# Altium schematic sheet Control_Sense_TOP_VAC.SchDoc (part 4 of 4)
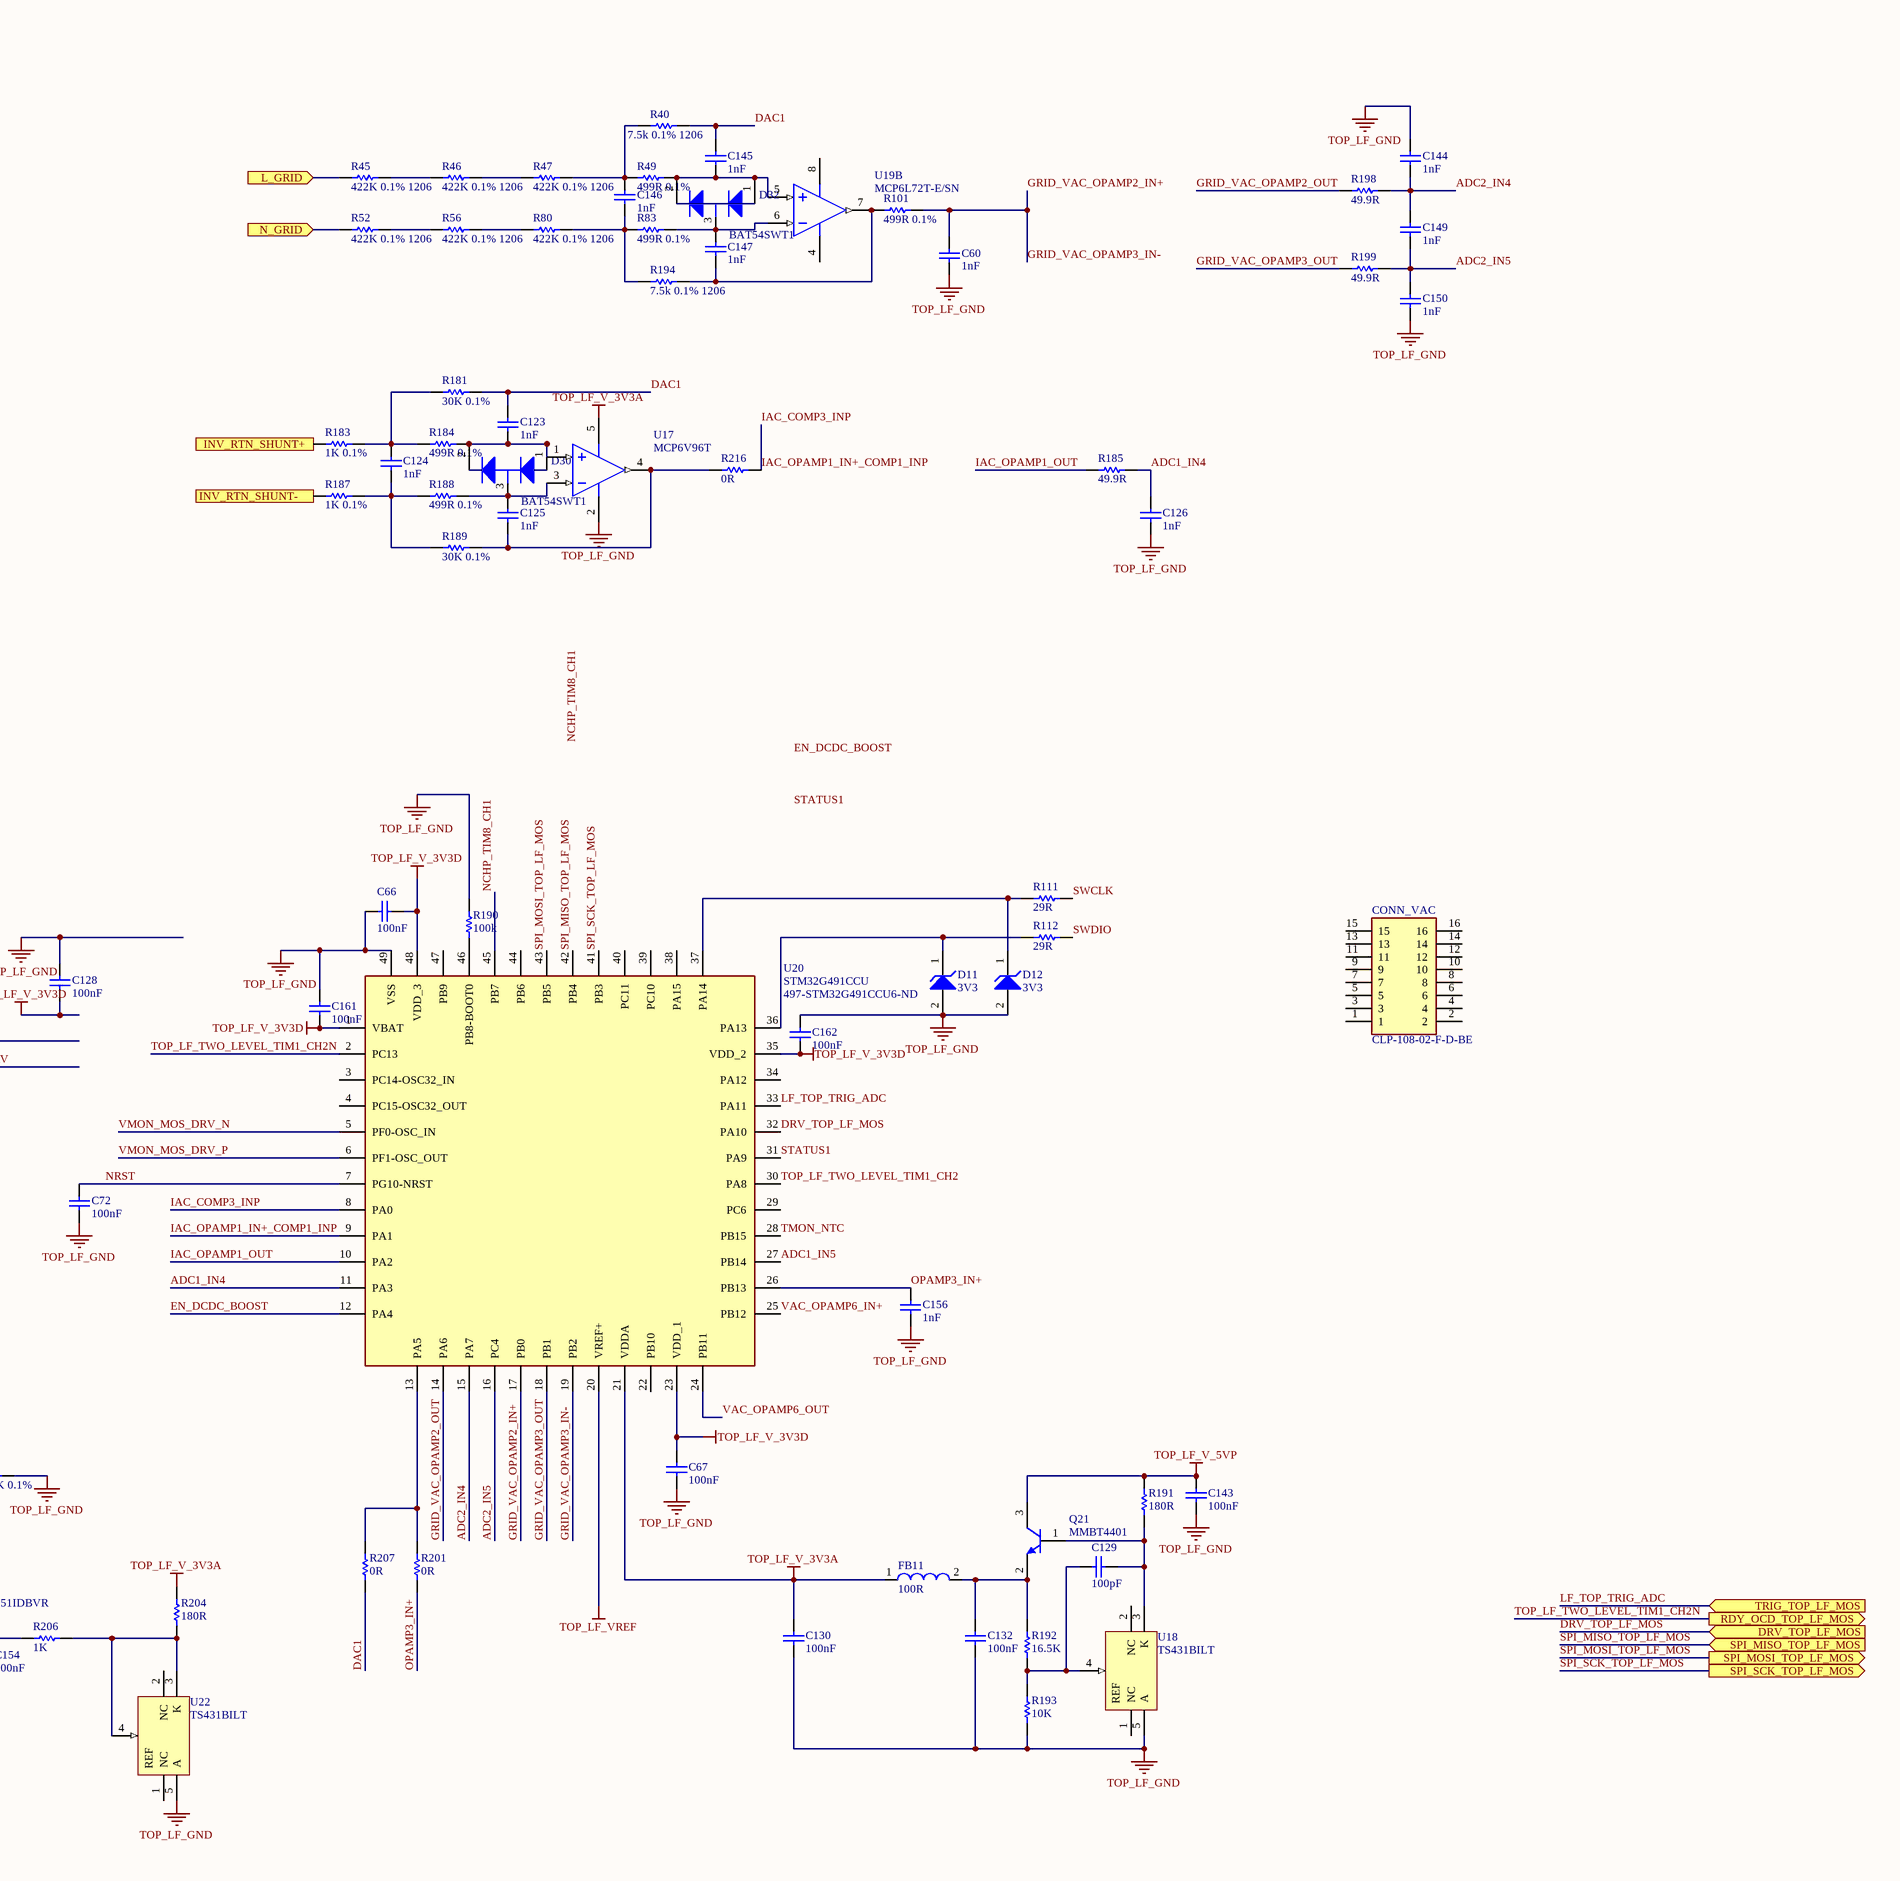
[diagram p6: Control_Sense_TOP_VAC.SchDoc, bottom right]

## Library data of the parts (continued)
R202 = CMP-2000-00873-1: Manufacturer: Panasonic; Part Number: ERA3AEB102V; Manufacturer Part Number: ERA-3AEB102V; Resistance: 1kR; Power Rating: 100mW; Temperature Coefficient: 25ppm/°C; Voltage Rating: 75V; Supplier 1: RSComponents; Supplier Part Number 1: 0566800P; RoHS: Yes; Category: Chip SMD Resistors; Stock 1: 1; Pricing 1: 5=0.38700, 50=0.32600, 250=0.12700, 1250=0.06600, 2500=0.04700 (USD); Mount: Surface Mount; Case/Package: 0603; Number of Pins: 2; Case Code (Imperial): 0603; Case Code (Metric): 1608; Contact Plating: Tin; Size Code: 0603; Min Operating Temperature: -55°C; Max Operating Temperature: 155°C; Packaging: Tape and Reel; Resistor Type: Thin Film; Tolerance: 0.1%; Number of Terminations: 2; Series: ERA-3A; Max Power Dissipation: 100mW; Construction: Rectangular; Package Quantity: 5000; Termination: SMD/SMT; Resistance Tolerance: 0.1%; Technology: METAL FILM; Length: 1.6mm; Width: 0.8mm; Height: 0.45mm; Depth: 0.8mm; Radiation Hardening: No; RoHS Compliant: Yes; Military Standard: Not; REACH SVHC: No SVHC; ComponentLink1URL: https://datasheet.ciiva.com/11808/0900766b80fe20f7-11808019.pdf?src-supplier=RSComponents; ComponentLink1Description: https://datasheet.ciiva.com/11808/0900766b80fe20f7-11808019.pdf?src-supplier=RSComponents; ComponentLink2URL: https://datasheet.ciiva.com/29183/450752-da-01-en-widerstand-0603-era-29183754.pdf?src-supplier=Conrad; ComponentLink2Description: https://datasheet.ciiva.com/29183/450752-da-01-en-widerstand-0603-era-29183754.pdf?src-supplier=Conrad; ComponentLink3URL: https://datasheet.ciiva.com/24071/aoa0000ce26-197354-24071510.pdf?src-supplier=Mouser; ComponentLink3Description: https://datasheet.ciiva.com/24071/aoa0000ce26-197354-24071510.pdf?src-supplier=Mouser; ComponentLink4URL: https://datasheet.ciiva.com/48530/era-eng-tds-48530582.pdf?src-supplier=Distrelec; ComponentLink4Description: https://datasheet.ciiva.com/48530/era-eng-tds-48530582.pdf?src-supplier=Distrelec; ComponentLink5URL: https://datasheet.ciiva.com/16781/70068849-16781703.pdf?src-supplier=Allied+Electronics; ComponentLink5Description: https://datasheet.ciiva.com/16781/70068849-16781703.pdf?src-supplier=Allied+Electronics; ComponentLink6URL: https://datasheet.ciiva.com/46422/1776116-46422455.pdf?src-supplier=Element14; ComponentLink6Description: https://datasheet.ciiva.com/46422/1776116-46422455.pdf?src-supplier=Element14; ComponentLink7URL: https://datasheet.ciiva.com/46422/485442-46422519.pdf?src-supplier=Element14; ComponentLink7Description: https://datasheet.ciiva.com/46422/485442-46422519.pdf?src-supplier=Element14; ComponentLink8URL: https://datasheet.ciiva.com/28531/485442-28531944.pdf?src-supplier=Element14; ComponentLink8Description: https://datasheet.ciiva.com/28531/485442-28531944.pdf?src-supplier=Element14; ComponentLink9URL: https://datasheet.ciiva.com/16426/aoa0000ce26-16426809.pdf?src-supplier=Future+Electronics; ComponentLink9Description: https://datasheet.ciiva.com/16426/aoa0000ce26-16426809.pdf?src-supplier=Future+Electronics; ComponentLink10URL: https://datasheet.ciiva.com/5734/aoa0000ce26-5734524.pdf?src-supplier=Farnell; ComponentLink10Description: https://datasheet.ciiva.com/5734/aoa0000ce26-5734524.pdf?src-supplier=Farnell; ComponentLink11URL: https://datasheet.ciiva.com/9198/aoa0000ce26-9198972.pdf?src-supplier=Avnet; ComponentLink11Description: https://datasheet.ciiva.com/9198/aoa0000ce26-9198972.pdf?src-supplier=Avnet; ComponentLink12URL: https://datasheet.ciiva.com/5734/485442-5734525.pdf?src-supplier=Farnell; ComponentLink12Description: https://datasheet.ciiva.com/5734/485442-5734525.pdf?src-supplier=Farnell; ComponentLink13URL: https://datasheet.ciiva.com/16725/70068849-16725038.pdf?src-supplier=Allied+Electronics; ComponentLink13Description: https://datasheet.ciiva.com/16725/70068849-16725038.pdf?src-supplier=Allied+Electronics; ComponentLink14URL: https://datasheet.ciiva.com/16853/aoa0000ce26-16853231.pdf?src-supplier=Avnet+Europe; ComponentLink14Description: https://datasheet.ciiva.com/16853/aoa0000ce26-16853231.pdf?src-supplier=Avnet+Europe; ComponentLink15URL: https://datasheet.ciiva.com/46393/1776116-46393695.pdf?src-supplier=Element14; ComponentLink15Description: https://datasheet.ciiva.com/46393/1776116-46393695.pdf?src-supplier=Element14
R203 = CMP-2000-00927-1: Part Number: ERA3AEB1651V; Manufacturer: Panasonic; Manufacturer Part Number: ERA-3AEB1651V; Resistance: 1.65kR; Power Rating: 100mW; Voltage Rating: 75V; Temperature Coefficient: 25ppm/°C; Supplier 1: Digi-Key; Supplier Part Number 1: P1.65KDBCT-ND; RoHS: Yes; Category: Chip SMD Resistors; Stock 1: 109834; Pricing 1: 1=0.31000, 10=0.26000, 100=0.10150, 1000=0.04248, 2500=0.03894 (USD); Mount: Surface Mount; Case/Package: 0603; Number of Pins: 2; Case Code (Imperial): 0603; Case Code (Metric): 1608; Contact Plating: Tin; Min Operating Temperature: -55°C; Max Operating Temperature: 155°C; Packaging: Tape and Reel; Tolerance: 0.1%; Resistor Type: Metal Film,Thin Film; Number of Terminations: 2; Package Quantity: 1; Voltage Rating (DC): 75V; Max Power Dissipation: 100mW; Features: Automotive AEC-Q200; Length: 1.6mm; Width: 0.8mm; Height: 0.45mm; Depth: 0.8mm; Radiation Hardening: No; REACH SVHC: No SVHC; Lead Free: Lead Free; Military Standard: Not; ComponentLink1URL: https://datasheet.ciiva.com/11809/0900766b80eb1d8c-11809743.pdf?src-supplier=RSComponents; ComponentLink1Description: https://datasheet.ciiva.com/11809/0900766b80eb1d8c-11809743.pdf?src-supplier=RSComponents; ComponentLink2URL: https://datasheet.ciiva.com/29183/451859-da-01-en-widerstand-0603-era-29183902.pdf?src-supplier=Conrad; ComponentLink2Description: https://datasheet.ciiva.com/29183/451859-da-01-en-widerstand-0603-era-29183902.pdf?src-supplier=Conrad; ComponentLink3URL: https://datasheet.ciiva.com/9197/aoa0000ce26-9197850.pdf?src-supplier=Avnet; ComponentLink3Description: https://datasheet.ciiva.com/9197/aoa0000ce26-9197850.pdf?src-supplier=Avnet; ComponentLink4URL: https://datasheet.ciiva.com/17214/aoa0000ce26-17214586.pdf?src-supplier=Avnet+Europe; ComponentLink4Description: https://datasheet.ciiva.com/17214/aoa0000ce26-17214586.pdf?src-supplier=Avnet+Europe; ComponentLink5URL: https://datasheet.ciiva.com/7920/485442-7920363.pdf?src-supplier=Element14; ComponentLink5Description: https://datasheet.ciiva.com/7920/485442-7920363.pdf?src-supplier=Element14; ComponentLink6URL: https://datasheet.ciiva.com/7920/485442-7920364.pdf?src-supplier=Element14; ComponentLink6Description: https://datasheet.ciiva.com/7920/485442-7920364.pdf?src-supplier=Element14
R205 = CMP-2000-00583-1: Manufacturer: Panasonic; Part Number: ERJ-3EKF59R0V; Power Rating: 100mW; Tolerance: 1%; Temperature Coefficient: 100ppm/°C; Voltage Rating: 75V; Voltage Rating (DC): 50V; Supplier 1: Digi-Key; Supplier Part Number 1: P59.0HCT-ND; Manufacturer Part Number: ERJ-3EKF59R0V; RoHS: Yes; Category: Chip SMD Resistors; Stock 1: 39151; Pricing 1: 1=0.10000, 10=0.03700, 100=0.01490, 1000=0.00670, 2500=0.00582 (USD); Mount: Surface Mount; Case/Package: 0603; Case Code (Metric): 1608; Case Code (Imperial): 0603; Contact Plating: Tin; Min Operating Temperature: -55°C; Max Operating Temperature: 155°C; Resistance: 59R; Packaging: Tape and Reel; Resistor Type: Thick Film; Number of Terminations: 2; Package Quantity: 1; Series: ERJ; Max Power Dissipation: 100mW; Termination: SMD/SMT; Resistance Tolerance: 1%; Features: Automotive AEC-Q200; Technology: THICK FILM; Construction: Rectangular; Length: 1.6mm; Width: 0.031inch; Height: 0.45mm; Depth: 0.8mm; RoHS Compliant: Yes; REACH SVHC: Yes; Lead Free: Contains Lead; Military Standard: Not; ComponentLink1URL: https://datasheet.ciiva.com/9188/aoa0000ce2-9188485.pdf?src-supplier=Avnet; ComponentLink1Description: https://datasheet.ciiva.com/9188/aoa0000ce2-9188485.pdf?src-supplier=Avnet; ComponentLink2URL: https://datasheet.ciiva.com/46420/1678782-46420341.pdf?src-supplier=Element14; ComponentLink2Description: https://datasheet.ciiva.com/46420/1678782-46420341.pdf?src-supplier=Element14; ComponentLink3URL: https://datasheet.ciiva.com/22729/1678782-22729158.pdf?src-supplier=Farnell; ComponentLink3Description: https://datasheet.ciiva.com/22729/1678782-22729158.pdf?src-supplier=Farnell; ComponentLink4URL: https://datasheet.ciiva.com/22673/1678782-22673800.pdf?src-supplier=Element14; ComponentLink4Description: https://datasheet.ciiva.com/22673/1678782-22673800.pdf?src-supplier=Element14; ComponentLink5URL: https://datasheet.ciiva.com/9188/aoa0000ce2-9188489.pdf?src-supplier=Avnet; ComponentLink5Description: https://datasheet.ciiva.com/9188/aoa0000ce2-9188489.pdf?src-supplier=Avnet; ComponentLink6URL: https://datasheet.ciiva.com/30242/aoa0000ce2-30242153.pdf?src-supplier=Onlinecomponents.com; ComponentLink6Description: https://datasheet.ciiva.com/30242/aoa0000ce2-30242153.pdf?src-supplier=Onlinecomponents.com; ComponentLink7URL: https://datasheet.ciiva.com/16777/70260748-16777979.pdf?src-supplier=Allied+Electronics; ComponentLink7Description: https://datasheet.ciiva.com/16777/70260748-16777979.pdf?src-supplier=Allied+Electronics
R216 = CMP-2100-03667-1: Chip Resistor, 0 Ohm, +/- 5%, 0.1 W, -55 to 155 degC, 0603 (1608 Metric), RoHS, Tape and Reel; Manufacturer: Yageo; Manufacturer Part Number: RC0603JR-070RL; Temperature Coefficient: 200ppm/degreesC; Voltage Rating: 50V; Power Rating: 100mW; Resistance: 0mOhm; Description: RES SMD 0 OHM JUMPER 1/10W 0603; Width: 0.8mm; Max Operating Temperature: 155degC; Tolerance: 5%; Package Reference: 0603; Height: 0.45mm; Depth: 0.8mm; Package Description: 2-Pin Surface Mount Device, Body 1.6 x 0.8 mm; Termination: SMD/SMT; Package Quantity: 5000; Case/Package: 0603; Case Code (Imperial): 0603; Radiation Hardening: No; Number of Pins: 2; Length: 1.6mm; Lead Free: LeadFree; Voltage Rating (DC): 50V; Military Standard: Not; Datasheet URL: http://www.yageo.com/NewPortal/yageodocoutput?fileName=/pdf/R-Chip/PYu-RC_Group_51_RoHS_L_5.pdf; Manufacturer URL: http://www.yageo.com/; Packaging: TapeandReel; Case Code (Metric): 1608; Min Operating Temperature: -55degC; Composition: ThickFilm; RoHSCompliant: true; Contact Plating: Tin; Datasheet Version: Rev. 5, 10/2016; REACH SVHC: NoSVHC; Supplier 1: Digi-Key; Supplier Part Number 1: 311-0.0GRCT-ND; RoHS: Yes; Category: Chip SMD Resistors; Stock 1: 8676367; Pricing 1: 1=0.10000, 10=0.01700, 25=0.01240, 50=0.00940, 100=0.00700, 250=0.00532, 500=0.00424, 1000=0.00313 (USD); Size Code: 0603; Resistor Type: Thick Film; Series: RC; Max Power Dissipation: 100mW; Construction: Rectangular; Number of Terminations: 2; Features: Moisture Resistant; Technology: THICK FILM; Resistance Tolerance: 5%; RoHS Compliant: Yes; ComponentLink1URL: https://datasheet.ciiva.com/11808/pyu-r-int-6-11808700.pdf?src-supplier=RSComponents; ComponentLink1Description: https://datasheet.ciiva.com/11808/pyu-r-int-6-11808700.pdf?src-supplier=RSComponents; ComponentLink2URL: https://datasheet.ciiva.com/22747/443971-22747530.pdf?src-supplier=Element14; ComponentLink2Description: https://datasheet.ciiva.com/22747/443971-22747530.pdf?src-supplier=Element14; ComponentLink3URL: https://datasheet.ciiva.com/12555/rc0603-272842-12555254.pdf?src-supplier=Mouser; ComponentLink3Description: https://datasheet.ciiva.com/12555/rc0603-272842-12555254.pdf?src-supplier=Mouser; ComponentLink4URL: https://datasheet.ciiva.com/7746/1738695-7746421.pdf?src-supplier=Element14; ComponentLink4Description: https://datasheet.ciiva.com/7746/1738695-7746421.pdf?src-supplier=Element14; ComponentLink5URL: https://datasheet.ciiva.com/7746/1738695-7746422.pdf?src-supplier=Element14; ComponentLink5Description: https://datasheet.ciiva.com/7746/1738695-7746422.pdf?src-supplier=Element14; ComponentLink6URL: https://datasheet.ciiva.com/8883/pyu-rc0603-51-rohs-l-4-8883045.pdf?src-supplier=Avnet; ComponentLink6Description: https://datasheet.ciiva.com/8883/pyu-rc0603-51-rohs-l-4-8883045.pdf?src-supplier=Avnet; ComponentLink7URL: https://datasheet.ciiva.com/15189/getdatasheetpartid-329462-15189845.pdf?src-supplier=Verical; ComponentLink7Description: https://datasheet.ciiva.com/15189/getdatasheetpartid-329462-15189845.pdf?src-supplier=Verical
U14 U18 U22 = CMP-0242-00042-1: 30mA, Low voltage adjustable shunt reference, 1.24 to 6V, 5-Pin SOT23-5, Tape and Reel; ComponentLink1URL: http://www.st.com; ComponentLink1Description: Manufacturer URL; ComponentLink2URL: http://www.st.com/internet/com/TECHNICAL_RESOURCES/TECHNICAL_LITERATURE/DATASHEET/CD00001336.pdf; PackageVersion: 2010; ComponentLink2Description: Datasheet; PackageReference: SOT23-5; PackageDescription: 5-Pin SOT-23 Package, 2.9 x 1.6 mm Body, 0.95 mm Pitch, 2.8 mm Lead Span; DatasheetVersion: Aug-2010
U15 = CMP-0859-00394-3: Single 2-Input Positive-AND Gate, DCK0005A, SMALL T&R; Generic Part Number: SN74AHC1G08; Manufacturer: Texas Instruments; Schmitt Trigger: No; ICC @ Nom Voltage(Max)(mA): 0.01; Technology Family: AHC; Output Drive (IOL/IOH)(Max)(mA): 50/-50; tpd @ Nom Voltage(Max)(ns): 12.3,7.9; Logic: True; Gate Type: AND; VCC(Min)(V): 2; Input Type: CMOS; Voltage(Nom)(V): 3.3,5; Bits(#): 1; VCC(Max)(V): 5.5; F @ Nom Voltage(Max)(Mhz): 75; Rating: Catalog; 3-State Output: No; Operating Temperature Range(C): -55 to 125; DatasheetVersion: SCLS314N; Sub-Family: AND Gate; Output Type: CMOS; PackageReference: DCK0005A
U16 = 1EDN8550B: Single-channel EiceDRIVER™ with true  differential inputs
U17 = CMP-0272-01102-3: 1 MHz, 45 uA, RRIO, Single Operational Amplifier, 2.1 to 5.5 V, -40 to 125 degC, 5-pin SOT23 (DCK5), Green (RoHS & no Sb/Br); PartNumber: OPA348AIDCKT; Manufacturer: Texas Instruments; Vio (25C)(Max)(mV): 5; Total Supply Voltage(Max)(+5V is 5, +/-5V is 10): 5.5; Slew Rate(Typ)(V/us): 0.5; Iq per channel(Max)(mA): 0.065; Number of Channels: 1; IIB(Max)(pA): 10; Packing: SMALL T&R; Offset Drift(Typ)(uV/C): 4; Sub Family: Low Input Bias Current Amp (<=10pA), Low Power Amp (<=500uA), Low Supply Voltage Amplifier (<=2.7V), Precision Amplifier; CMRR(Min)(dB): 70; Rating: Catalog; Total Supply Voltage(Min)(+5V is 5, +/-5V is 10): 2.1; Code_JEDEC: MO-203; ComponentLink2Description: Datasheet; Mounting Technology: Surface Mount; ComponentLink1URL: http://www.ti.com/; ComponentLink3URL: http://www.ti.com/litv/pdf/mpds025f; PackageVersion: 4093553-3/G, 01/2007; DatasheetVersion: SBOS213G; PackageReference: DCK0005A; ComponentLink2URL: http://www.ti.com/lit/ds/symlink/opa348.pdf; PackageDescription: 5-Pin Plastic Small Outline, Body 2 x 1.25 mm, Pitch 0.65 mm; GBW(Typ)(MHz): 1; ComponentLink3Description: Package Specification; ComponentLink1Description: Manufacturer URL; Eco-Plan: Green (RoHS & no Sb/Br)
U19 = AMP-OPA-MCP602-IL8: 2.8 MHz, 150 Î¼A Dual Op Amp, 8-Pin SOIC, Extended Temperature Range, Tape and Reel; ComponentLink2Description: Datasheet; Code_IPC: SOIC127P600-8; DatasheetVersion: revA, Mar-2009; Code_JEDEC: MS-012; ComponentLink3Description: Package Specification; PackageDescription: 8-Lead Plastic Small Outline (SN) - Narrow, 3.90mm Body [SOIC]; PackageVersion: revBB, Aug-2009; ComponentLink2URL: http://ww1.microchip.com/downloads/en/DeviceDoc/22145a.pdf; PackageReference: SOIC-SN8; ComponentLink3URL: http://www.microchip.com/stellent/groups/techpub_sg/documents/packagingspec/en012702.pdf; RevisionNote: URLs added.; ComponentLink1URL: http://www.microchip.com/; ComponentLink1Description: Manufacturer URL
U20 = STM32G491CCU: Manufacturer: STMicroelectronics; Manufacturer Part Number: STM32G491CCU6; Supplier 1: Digi-Key; RoHS: Yes
U21 = CMP-0187-00454-2: 2.8 MHz, 150 Î¼A Op Amp, 5-Pin SOT-23, Extended Temperature Range, Tape and Reel; Code_IPC: SOT23-5; PackageDescription: 5-Lead Plastic Small Outline Transistor (OT) [SOT-23]; PackageReference: SOT-23-OT5; ComponentLink3URL: http://www.microchip.com/stellent/groups/techpub_sg/documents/packagingspec/en012702.pdf; ComponentLink1Description: Manufacturer URL; ComponentLink2URL: http://ww1.microchip.com/downloads/en/DeviceDoc/22145a.pdf; ComponentLink2Description: Datasheet; PackageVersion: revBB, Aug-2009; RevisionNote: URLs added.; ComponentLink1URL: http://www.microchip.com/; DatasheetVersion: revA, Mar-2009; ComponentLink3Description: Package Specification